# EAGLE design main (EAGLE 7.1.0)
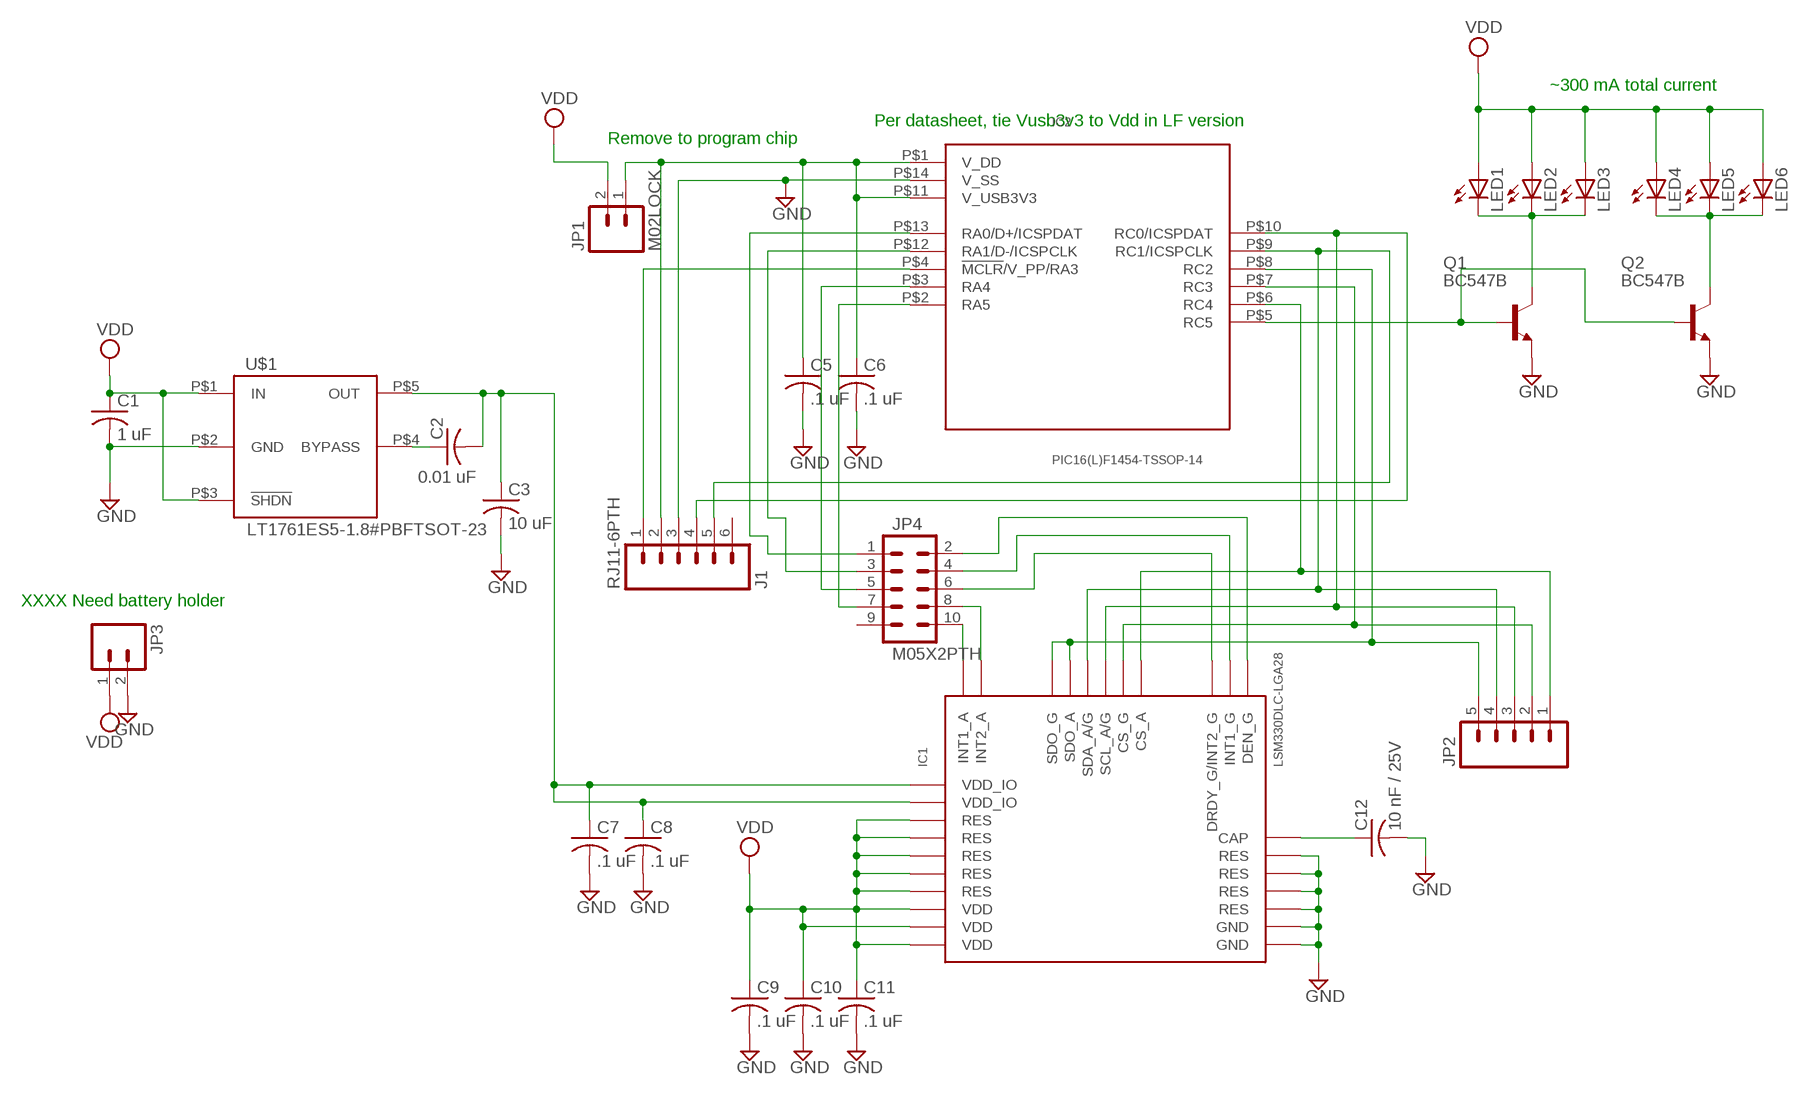
[diagram p0: schematic, sheet 1]

## Parts
C1  1 uF  C-USC1206  [C1206]
C2  0.01 uF  C-USC1206  [C1206]
C3  10 uF  C-USC1206  [C1206]
C5  .1 uF  C-USC1206  [C1206]
C6  .1 uF  C-USC1206  [C1206]
C7  .1 uF  C-USC1206  [C1206]
C8  .1 uF  C-USC1206  [C1206]
C9  .1 uF  C-USC1206  [C1206]
C10  .1 uF  C-USC1206  [C1206]
C11  .1 uF  C-USC1206  [C1206]
C12  10 nF / 25V  C-USC1206  [C1206]
IC1  LSM330DLC-LGA28  [LGA-28]
IC2  PIC16(L)F1454-TSSOP-14  [TSSOP-14]
J1  RJ11-6PTH  [RJ11-6]
JP1  M02LOCK  [1X02_LOCK]
JP2  M05PTH  [1X05]
JP3  M02LOCK  [1X02_LOCK]
JP4  M05X2PTH  [AVR_ICSP]
LED1  LED5MM  [LED5MM]
LED2  LED5MM  [LED5MM]
LED3  LED5MM  [LED5MM]
LED4  LED5MM  [LED5MM]
LED5  LED5MM  [LED5MM]
LED6  LED5MM  [LED5MM]
Q1  BC547B  [TO92]
Q2  BC547B  [TO92]
U$1  LT1761ES5-1.8#PBFTSOT-23  [TSOT-23]

## Nets
GND: C1.2 C3.2 C5.2 C6.2 C7.2 C8.2 C9.2 C10.2 C11.2 C12.2 IC1.P$1(GND) IC1.P$2(RES) IC1.P$3(RES) IC1.P$4(RES) IC1.P$5(RES) IC1.P$6(GND) IC2.P$14(V_SS) J1.3 JP3.2 Q1.1(E) Q2.1(E) U$1.P$2(GND)
N$1: C2.2 C3.1 C7.1 C8.1 IC1.P$21(VDD_IO) IC1.P$25(VDD_IO) U$1.P$5(OUT)
N$2: C2.1 U$1.P$4(BYPASS)
N$6: IC2.P$4(!MCLR!/V_PP/RA3) J1.1
N$7: C5.1 C6.1 IC2.P$1(V_DD) IC2.P$11(V_USB3V3) J1.2 JP1.1
N$8: IC1.P$24(SCL_A/G) IC2.P$10(RC0/ICSPDAT) J1.4 JP2.3
N$9: IC1.P$28(SDA_A/G) IC2.P$9(RC1/ICSPCLK) J1.5 JP2.4
N$10: IC1.P$26(SDO_G) IC1.P$27(SDO_A) IC2.P$8(RC2) JP2.5
N$11: LED1.K(C) LED2.K(C) LED3.K(C) Q1.3(C)
N$12: IC1.P$22(CS_G) IC2.P$7(RC3) JP2.2
N$13: IC1.P$23(CS_A) IC2.P$6(RC4) JP2.1
N$14: LED4.K(C) LED5.K(C) LED6.K(C) Q2.3(C)
N$15: IC2.P$5(RC5) Q1.2(B) Q2.2(B)
N$16: IC2.P$13(RA0/D+/ICSPDAT) JP4.1
N$17: IC1.P$20(INT1_A) JP4.10
N$18: IC1.P$19(INT2_A) JP4.8
N$19: IC1.P$17(DRDY_G/INT2_G) JP4.6
N$20: IC1.P$18(INT1_G) JP4.4
N$21: IC1.P$16(DEN_G) JP4.2
N$22: IC2.P$12(RA1/D-/ICSPCLK) JP4.3
N$23: IC2.P$3(RA4) JP4.5
N$24: IC2.P$2(RA5) JP4.7
N$25: C12.1 IC1.P$15(CAP)
VDD: C1.1 C9.1 C10.1 C11.1 IC1.P$7(VDD) IC1.P$8(VDD) IC1.P$9(VDD) IC1.P$10(RES) IC1.P$11(RES) IC1.P$12(RES) IC1.P$13(RES) IC1.P$14(RES) JP1.2 JP3.1 LED1.A LED2.A LED3.A LED4.A LED5.A LED6.A U$1.P$1(IN) U$1.P$3(!SHDN!)
Unconnected: J1.6 JP4.9

## Notes on the sheet
- ~300 mA total current
- Per datasheet, tie Vusb3v3 to Vdd in LF version
- Remove to program chip
- XXXX Need battery holder

## Library data of the parts
C1-C3 C5-C12 = rcl:C-US: CAPACITOR, American symbol
IC1 = leds:LSM330DLC
IC2 = leds:PIC16(L)F1454
J1 = SparkFun-Connectors:RJ11-6: RJ11 Jack Simple 6 pin RJ11 jack. Commonly found on CAT3 devices and Microchip programmers. SKU: PRT-00132
JP1 JP3 = SparkFun-Connectors:M02: Standard 2-pin 0.1" header. Use with - straight break away headers ( PRT-00116) - right angle break away headers (PRT-00553) - swiss pins (PRT-00743) - machine pins (PRT-00117) - female headers (PRT-00115) Molex polarized connector foot print use with: PRT-08233 with associated crimp pins and housings. 2.54_SCREWTERM for use with PRT-10571. 3.5mm Screw Terminal footprints for PRT-08084 5mm Screw Terminal footprints for use with PRT-08432
JP2 = SparkFun-Connectors:M05: Header 5 Standard 5-pin 0.1" header. Use with straight break away headers (SKU : PRT-00116), right angle break away headers (PRT-00553), swiss pins (PRT-00743), machine pins (PRT-00117), and female headers (PRT-00115). Molex polarized connector foot print use with SKU : PRT-08230 with associated crimp pins and housings.
JP4 = SparkFun-Connectors:M05X2: Header 5x2 Standard 10-pin dual row 0.1" header. Commonly used with AVR-ISP. Use with Spark Fun Electronics SKU: PRT-00778
LED1-LED6 = led:LED: LED OSRAM: - CHIPLED LG R971, LG N971, LY N971, LG Q971, LY Q971, LO R971, LY R971 LH N974, LH R974 LS Q976, LO Q976, LY Q976 LO Q996 - Hyper CHIPLED LW Q18S LB Q993, LB Q99A, LB R99A - SideLED LS A670, LO A670, LY A670, LG A670, LP A670 LB A673, LV A673, LT A673, LW A673 LH A674 LY A675 LS A676, LA A676, LO A676, LY A676, LW A676 LS A679, LY A679, LG A679 - Hyper Micro SIDELED® LS Y876, LA Y876, LO Y876, LY Y876 LT Y87S - SmartLED LW L88C, LW L88S LB L89C, LB L89S, LG L890 LS L89K, LO L89K, LY L89K LS L896, LA L896, LO L896, LY L896 - TOPLED LS T670, LO T670, LY T670, LG T670, LP T670 LSG T670, LSP T670, LSY T670, LOP T670, LYG T670 LG T671, LOG T671, LSG T671 LB T673, LV T673, LT T673, LW T673 LH T674 LS T676, LA T676, LO T676, LY T676, LB T676, LH T676, LSB T676, LW T676 LB T67C, LV T67C, LT T67C, LS T67K, LO T67K, LY T67K, LW E67C LS E67B, LA E67B, LO E67B, LY E67B, LB E67C, LV E67C, LT E67C LW T67C LS T679, LY T679, LG T679 LS T770, LO T770, LY T770, LG T770, LP T770 LB T773, LV T773, LT T773, LW T773 LH T774 LS E675, LA E675, LY E675, LS T675 LS T776, LA T776, LO T776, LY T776, LB T776 LHGB T686 LT T68C, LB T68C - Hyper Mini TOPLED® LB M676 - Mini TOPLED Santana® LG M470 LS M47K, LO M47K, LY M47K Source: http://www.osram.convergy.de LUXEON: - LUMILED® LXK2-PW12-R00, LXK2-PW12-S00, LXK2-PW14-U00, LXK2-PW14-V00 LXK2-PM12-R00, LXK2-PM12-S00, LXK2-PM14-U00 LXK2-PE12-Q00, LXK2-PE12-R00, LXK2-PE12-S00, LXK2-PE14-T00, LXK2-PE14-U00 LXK2-PB12-K00, LXK2-PB12-L00, LXK2-PB12-M00, LXK2-PB14-N00, LXK2-PB14-P00, LXK2-PB14-Q00 LXK2-PR12-L00, LXK2-PR12-M00, LXK2-PR14-Q00, LXK2-PR14-R00 LXK2-PD12-Q00, LXK2-PD12-R00, LXK2-PD12-S00 LXK2-PH12-R00, LXK2-PH12-S00 LXK2-PL12-P00, LXK2-PL12-Q00, LXK2-PL12-R00 Source: www.luxeon.com KINGBRIGHT: KA-3528ASYC Source: www.kingbright.com
Q1 Q2 = transistor-npn:BC547*: NPN Transistor
U$1 = leds:LT1761ES5-1.8#PBF

## Board
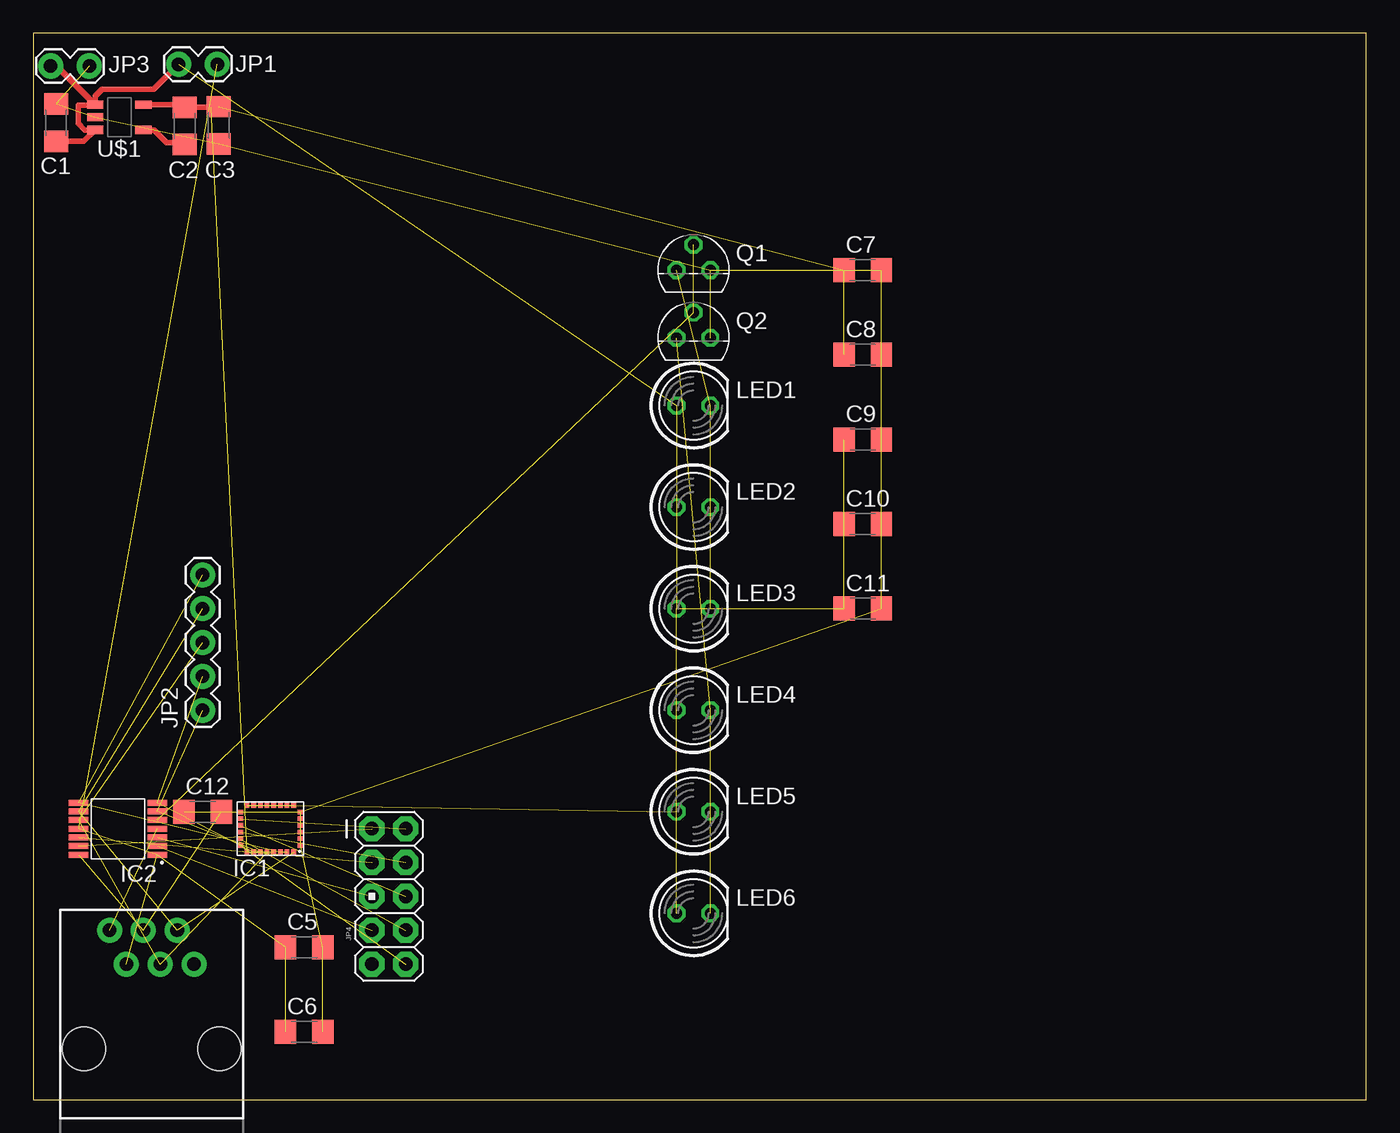
[diagram p1: board, top side]

Size 100 x 80 mm. Coordinates in mm from the lower left corner, seen from the top.
Outline: 0,0 100,0 100,80 0,80 0,0
Copper layers (1*16): Top 0.035mm / dielectric 1.5mm / Bottom 0.035mm
Design rules "default": minimum track width 10mil, minimum drill 24mil, track to track 8mil, track to pad 8mil, pad to pad 8mil, via to via 8mil, smd to smd 8mil, copper to edge 40mil, drill to drill 8mil, minimum pad ring 10mil, minimum via ring 8mil, stop-mask expansion 4mil, vias tented up to drill 0mil, thermal gap 10mil

### Footprints (pad centres in the part's own frame; a part is rotated, then mirrored left to right if it is on the bottom)
C1206 = smd 1.6 x 1.8: 1 -1.4,0; 2 1.4,0
LGA-28 = smd 0.425 x 0.35: P$1 -2.263,1.25; P$2 -2.263,0.75; P$3 -2.263,0.25; P$4 -2.263,-0.25; P$5 -2.263,-0.75; P$6 -2.263,-1.25; P$15 2.263,-1.25; P$16 2.263,-0.75; P$17 2.263,-0.25; P$18 2.263,0.25; P$19 2.263,0.75; P$20 2.263,1.25 | smd 0.35 x 0.425: P$7 -1.75,-1.762; P$8 -1.25,-1.762; P$9 -0.75,-1.762; P$10 -0.25,-1.762; P$11 0.25,-1.762; P$12 0.75,-1.762; P$13 1.25,-1.762; P$14 1.75,-1.762; P$21 1.75,1.762; P$22 1.25,1.762; P$23 0.75,1.762; P$24 0.25,1.762; P$25 -0.25,1.762; P$26 -0.75,1.762; P$27 -1.25,1.762; P$28 -1.75,1.762
TSSOP-14 = smd 1.45 x 0.45: P$1 -2.95,1.95; P$2 -2.95,1.3; P$3 -2.95,0.65; P$4 -2.95,0; P$5 -2.95,-0.65; P$6 -2.95,-1.3; P$7 -2.95,-1.95; P$8 2.95,-1.95; P$9 2.95,-1.3; P$10 2.95,-0.65; P$11 2.95,0; P$12 2.95,0.65; P$13 2.95,1.3; P$14 2.95,1.95
RJ11-6 = drill 1.016 pad 1.88: 1 1.905,8.89; 2 3.175,6.35; 3 4.445,8.89; 4 5.715,6.35; 5 6.985,8.89; 6 8.255,6.35 | hole 3.251: 0,0; 10.16,0
1X02_LOCK = drill 1.016 pad 1.88: 1 -0.178,0; 2 2.718,0
1X05 = drill 1.016 pad 1.88: 1 0,0; 2 2.54,0; 3 5.08,0; 4 7.62,0; 5 10.16,0
AVR_ICSP = drill 1.016 pad 1.88 octagon: 1 -1.27,5.08; 2 1.27,5.08; 3 -1.27,2.54; 4 1.27,2.54; 5 -1.27,0; 6 1.27,0; 7 -1.27,-2.54; 8 1.27,-2.54; 9 -1.27,-5.08; 10 1.27,-5.08
LED5MM = drill 0.813 octagon: A -1.27,0; K 1.27,0
TO92 = drill 0.813 octagon: 1 1.27,0; 2 0,1.905; 3 -1.27,0
TSOT-23 = smd 0.62 x 1.22: P$1 -0.95,-1.81; P$2 0,-1.81; P$3 0.95,-1.81; P$4 0.95,1.81; P$5 -0.95,1.81

### Placement (x,y rotation side)
C1  1.7,73.3 90 top
C2  11.35,73.05 90 top
C3  13.9,73.1 270 top
C5  20.32,11.43 0 top
C6  20.32,5.08 0 top
C7  62.23,62.23 0 top
C8  62.23,55.88 0 top
C9  62.23,49.53 0 top
C10  62.23,43.18 0 top
C11  62.23,36.83 0 top
C12  12.7,21.59 0 top
IC1  17.78,20.32 180 top
IC2  6.35,20.32 180 top
J1  3.81,3.81 0 top
JP1  13.62,77.67 180 top
JP2  12.7,29.21 90 top
JP3  1.48,77.55 0 top
JP4  26.67,15.24 0 top
LED1  49.53,52.07 0 top
LED2  49.53,44.45 0 top
LED3  49.53,36.83 0 top
LED4  49.53,29.21 0 top
LED5  49.53,21.59 0 top
LED6  49.53,13.97 0 top
Q1  49.53,62.23 0 top
Q2  49.53,57.15 0 top
U$1  6.45,73.7 270 top

### Tracks (layer width: path | path; a pad name or v marks a point on that pad's centre or on a via)
GND  (21 unrouted)
N$1  (4 unrouted)
  Top 0.406: U$1.P$5 10.5,74.65 C2.2 13.35,74.45 C3.1
N$2
  Top 0.406: U$1.P$4 9.05,72.75 10,71.8 11.2,71.8 C2.1
N$6  (1 unrouted)
N$7  (5 unrouted)
N$8  (3 unrouted)
N$9  (3 unrouted)
N$10  (3 unrouted)
N$11  (3 unrouted)
N$12  (2 unrouted)
N$13  (2 unrouted)
N$14  (3 unrouted)
N$15  (2 unrouted)
N$16  (1 unrouted)
N$17  (1 unrouted)
N$18  (1 unrouted)
N$19  (1 unrouted)
N$20  (1 unrouted)
N$21  (1 unrouted)
N$22  (1 unrouted)
N$23  (1 unrouted)
N$24  (1 unrouted)
N$25  (1 unrouted)
VDD  (17 unrouted)
  Top 0.406: JP3.1 1.74,77.55 U$1.P$1 | C1.1 3.79,71.9 U$1.P$3 3.85,72.75 3.35,73.25 3.35,74.6 4.59,74.6 U$1.P$1 | U$1.P$1 4.64,75.29 5.15,75.8 9.03,75.8 JP1.2